# Altium schematic sheet Paddle_1.SchDoc: Paddle 1
size A4
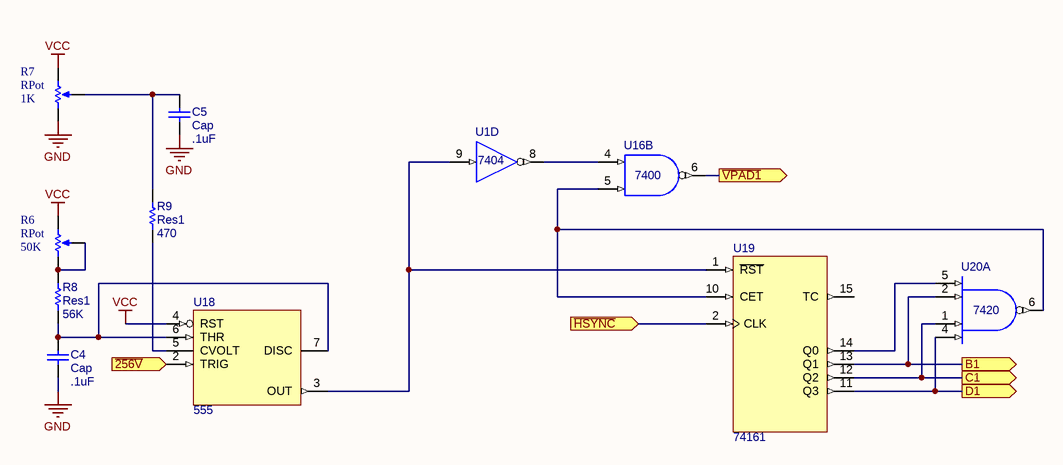
[diagram p0: Paddle_1.SchDoc]

## Parts
C4  Cap  value .1uF  [CAPR10.16-11.5x3.6]
C5  Cap  value .1uF  [CAPR10.16-11.5x3.6]
R6  RPot  value 50K  [TRIMPOT_THT_PV36X]
R7  RPot  value 1K  [VR5]
R8  Res1  value 56K  [AXIAL-0.4]
R9  Res1  value 470  [AXIAL-0.4]
U1  7404  [N014]  (part D of 6)
U16  7400  [N014]  (part B of 4)
U18  555  [P008]
U19  74161  [N016]
U20  7420  [N014]  (part A of 2)

## Ports
B1, C1, D1, ~{256V}, ~{HSYNC}, ~{VPAD1}

## Nets
GND: C4.1 C5.1 R7.1(TOP) U1.7(GND) U16.7(GND) U18.1(GND) U19.8(GND) U20.7(GND)
VCC: R6.CW(BOT) R7.2(BOT) U1.14(VCC) U16.14(VCC) U18.4(RST) U18.8(VCC) U19.3(P0) U19.4(P1) U19.5(P2) U19.6(P3) U19.7(CEP) U19.9(~{PE}) U19.16(VCC) U20.14(VCC)
~{256V}: U18.2(TRIG) ; port ~{256V}
~{HSYNC}: U19.2(CLK) ; port ~{HSYNC}
~{VPAD1}: U16.6(Y) ; port ~{VPAD1}
B1: U19.13(Q1) U20.2(B) ; port B1
C1: U19.12(Q2) U20.1(A) ; port C1
D1: U19.11(Q3) U20.4(C) ; port D1
NetC4_2: C4.2 R8.1 U18.6(THR) U18.7(DISC)
NetC5_2: C5.2 R7.3(TAP) R9.2
NetR6_CCW: R6.CCW(TOP) R6.W(TAP) R8.2
NetR9_1: R9.1 U18.5(CVOLT)
NetU1_8: U1.8(Y) U16.4(A)
NetU1_9: U1.9(A) U18.3(OUT) U19.1(~{RST})
NetU16_5: U16.5(B) U19.10(CET) U20.6(Y)
NetU19_14: U19.14(Q0) U20.5(D)

Not connected (* = marked no-connect by the designer): U19 15(TC)

## Notes on the sheet
- Text
- Page
- PONG

## Library data of the parts
C4 C5 = Cap: Capacitor; Published: 8-Jun-2000; LatestRevisionDate: 17-Jul-2002; LatestRevisionNote: Re-released for DXP Platform.; PackageReference: RAD-0.3; Publisher: Altium Limited; PackageDescription: Radial Cap, Thru-Hole; 2 Leads; 0.3 in Pin Spacing
R6 R7 = RPot: Potentiometer; Sim Note: Enter the Resistance value and the set point into parameter fields.; Set Position: 0.5; Published: 8-Jun-2000; LatestRevisionDate: 17-Jul-2002; LatestRevisionNote: Re-released for DXP Platform.; PackageReference: VR5; Publisher: Altium Limited; PackageDescription: Variable Resistor, Thru-Hole; 3 Leads
R8 R9 = Res1: Resistor; Published: 8-Jun-2000; LatestRevisionDate: 17-Jul-2002; LatestRevisionNote: Re-released for DXP Platform.; PackageReference: AXIAL-0.3; Publisher: Altium Limited; PackageDescription: Axial Device, Thru-Hole; 2 Leads; 0.3 in Pin Spacing
U1 = SN74LS04N: Hex Inverter; Published: 8-Jun-2000; LatestRevisionDate: 04-Mar-2005; LatestRevisionNote: Stylized 3D Model Added.; DatasheetVersion: Mar-1988; PackageVersion: Oct-1995; PackageReference: N014; Publisher: Altium Limited; PackageDescription: DIP; 14 Leads; Row Spacing 7.62 mm; Pitch 2.54 mm; ComponentLink1Description: Manufacturer Link; ComponentLink1URL: http://www.ti.com/; ComponentLink2Description: Datasheet; ComponentLink2URL: http://www-s.ti.com/sc/ds/sn74ls04.pdf
U16 = SN74LS00N: Quadruple 2-Input Positive-NAND Gate; Published: 8-Jun-2000; LatestRevisionDate: 04-Mar-2005; LatestRevisionNote: Stylized 3D Model Added.; DatasheetVersion: Mar-1988; PackageVersion: Oct-1995; PackageReference: N014; Publisher: Altium Limited; PackageDescription: DIP; 14 Leads; Row Spacing 7.62 mm; Pitch 2.54 mm; ComponentLink1Description: Manufacturer Link; ComponentLink1URL: http://www.ti.com/; ComponentLink2Description: Datasheet; ComponentLink2URL: http://www-s.ti.com/sc/ds/sn74ls00.pdf
U18 = NE555P: Precision Timer; Published: 16-Jan-2001; LatestRevisionDate: 04-Mar-2005; LatestRevisionNote: Stylized 3D Model Added.; DatasheetVersion: Feb-1992; PackageVersion: Jun-1999; PackageReference: P008; Publisher: Altium Limited; PackageDescription: DIP; 8 Leads; Row Spacing 7.62 mm; Pitch 2.54 mm; Code_JEDEC: MO-001-AN; ComponentLink1Description: Manufacturer Link; ComponentLink1URL: http://www.ti.com/; ComponentLink2Description: Datasheet; ComponentLink2URL: http://www-s.ti.com/sc/ds/ne555.pdf
U19 = SN74LS161AN: Synchronous 4-Bit Counter; Published: 8-Jun-2000; LatestRevisionDate: 04-Mar-2005; LatestRevisionNote: Stylized 3D Model Added.; DatasheetVersion: Mar-1988; PackageVersion: Oct-1995; PackageReference: N016; Publisher: Altium Limited; PackageDescription: DIP; 16 Leads; Row Spacing 7.62 mm; Pitch 2.54 mm; Code_JEDEC: MS-001-BB; ComponentLink1Description: Manufacturer Link; ComponentLink1URL: http://www.ti.com/; ComponentLink2Description: Datasheet; ComponentLink2URL: http://www-s.ti.com/sc/ds/sn74ls161a.pdf; ComponentLink3Description: URL Link1; ComponentLink3URL: http://focus.ti.com/docs/prod/folders/print/sn74ls161a.html
U20 = SN74LS20N: Dual 4-Input Positive-NAND Gate; Note: Pins 3 and 11 are NC & not drawn.; Published: 8-Jun-2000; LatestRevisionDate: 04-Mar-2005; LatestRevisionNote: Stylized 3D Model Added.; DatasheetVersion: Mar-1988; PackageVersion: Oct-1995; PackageReference: N014; Publisher: Altium Limited; PackageDescription: DIP; 14 Leads; Row Spacing 7.62 mm; Pitch 2.54 mm; ComponentLink1Description: Manufacturer Link; ComponentLink1URL: http://www.ti.com/; ComponentLink2Description: Datasheet; ComponentLink2URL: http://www-s.ti.com/sc/ds/sn74ls20.pdf